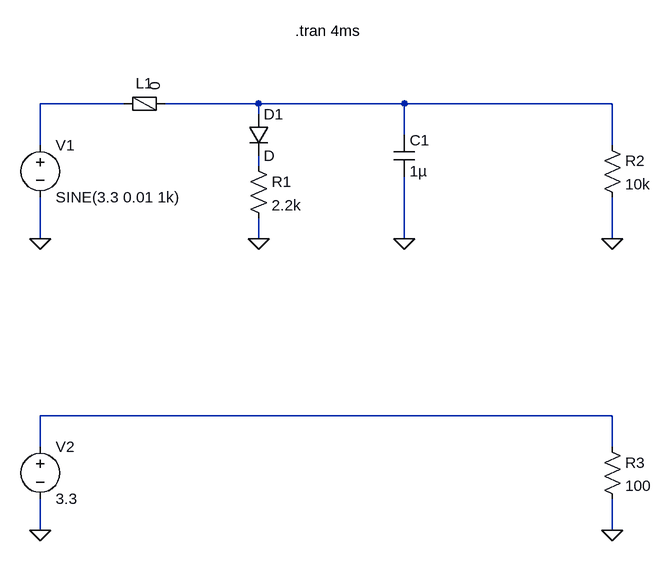
[diagram p0: schematic TemperatureSensor.asc]
TemperatureSensor.asc, the LTspice schematic file:
Version 4
SHEET 1 964 848
WIRE 64 176 -64 176
WIRE 272 176 128 176
WIRE 496 176 272 176
WIRE 816 176 496 176
WIRE 272 192 272 176
WIRE 496 224 496 176
WIRE -64 240 -64 176
WIRE 816 240 816 176
WIRE 272 272 272 256
WIRE -64 384 -64 320
WIRE 272 384 272 352
WIRE 496 384 496 288
WIRE 816 384 816 320
WIRE 816 656 -64 656
WIRE -64 704 -64 656
WIRE 816 704 816 656
WIRE -64 832 -64 784
WIRE 816 832 816 784
FLAG 272 384 0
FLAG 496 384 0
FLAG 816 384 0
FLAG -64 384 0
FLAG 816 832 0
FLAG -64 832 0
SYMBOL FerriteBead 96 176 R270
WINDOW 0 16 0 VTop 2
SYMATTR InstName L1
SYMATTR Value 0
SYMATTR SpiceLine Rser=100 Rpar=0 Cpar=0
SYMBOL res 256 256 R0
SYMATTR InstName R1
SYMATTR Value 2.2k
SYMBOL diode 256 192 R0
SYMATTR InstName D1
SYMBOL cap 480 224 R0
SYMATTR InstName C1
SYMATTR Value 1µ
SYMBOL voltage -64 224 R0
SYMATTR InstName V1
SYMATTR Value SINE(3.3 0.01 1k)
SYMBOL res 800 224 R0
SYMATTR InstName R2
SYMATTR Value 10k
SYMBOL res 800 688 R0
SYMATTR InstName R3
SYMATTR Value 100
SYMBOL voltage -64 688 R0
SYMATTR InstName V2
SYMATTR Value 3.3
TEXT 328 64 Left 2 !.tran 4ms

The netlist it stands for:
* TemperatureSensor.asc
L1 N001 N002 0 Rser=100 Rpar=0 Cpar=0
R1 N003 0 2.2k
D1 N002 N003 D
C1 N002 0 1µ
V1 N001 0 SINE(3.3 0.01 1k)
R2 N002 0 10k
R3 N004 0 100
V2 N004 0 3.3
.model D D
.lib standard.dio
.tran 4ms
.backanno
.end